# Altium schematic sheet Channels.SchDoc: А
size 420 x 594 mm; ApprovedBy: Крысин; CheckedBy: Крысин; Author: Борисов; DrawnBy: Хрущева; DocumentNumber: 1; SheetNumber: 1; SheetTotal: 1; Title string 2: Плата; Title string 3: HUB IOLINK Cross; Type: Схема электрическая принципиальная; DecimalNumber: БНРД.xxxxxx.xxxЭ3; MainDevice: БНРД.xxxxxx.xxx
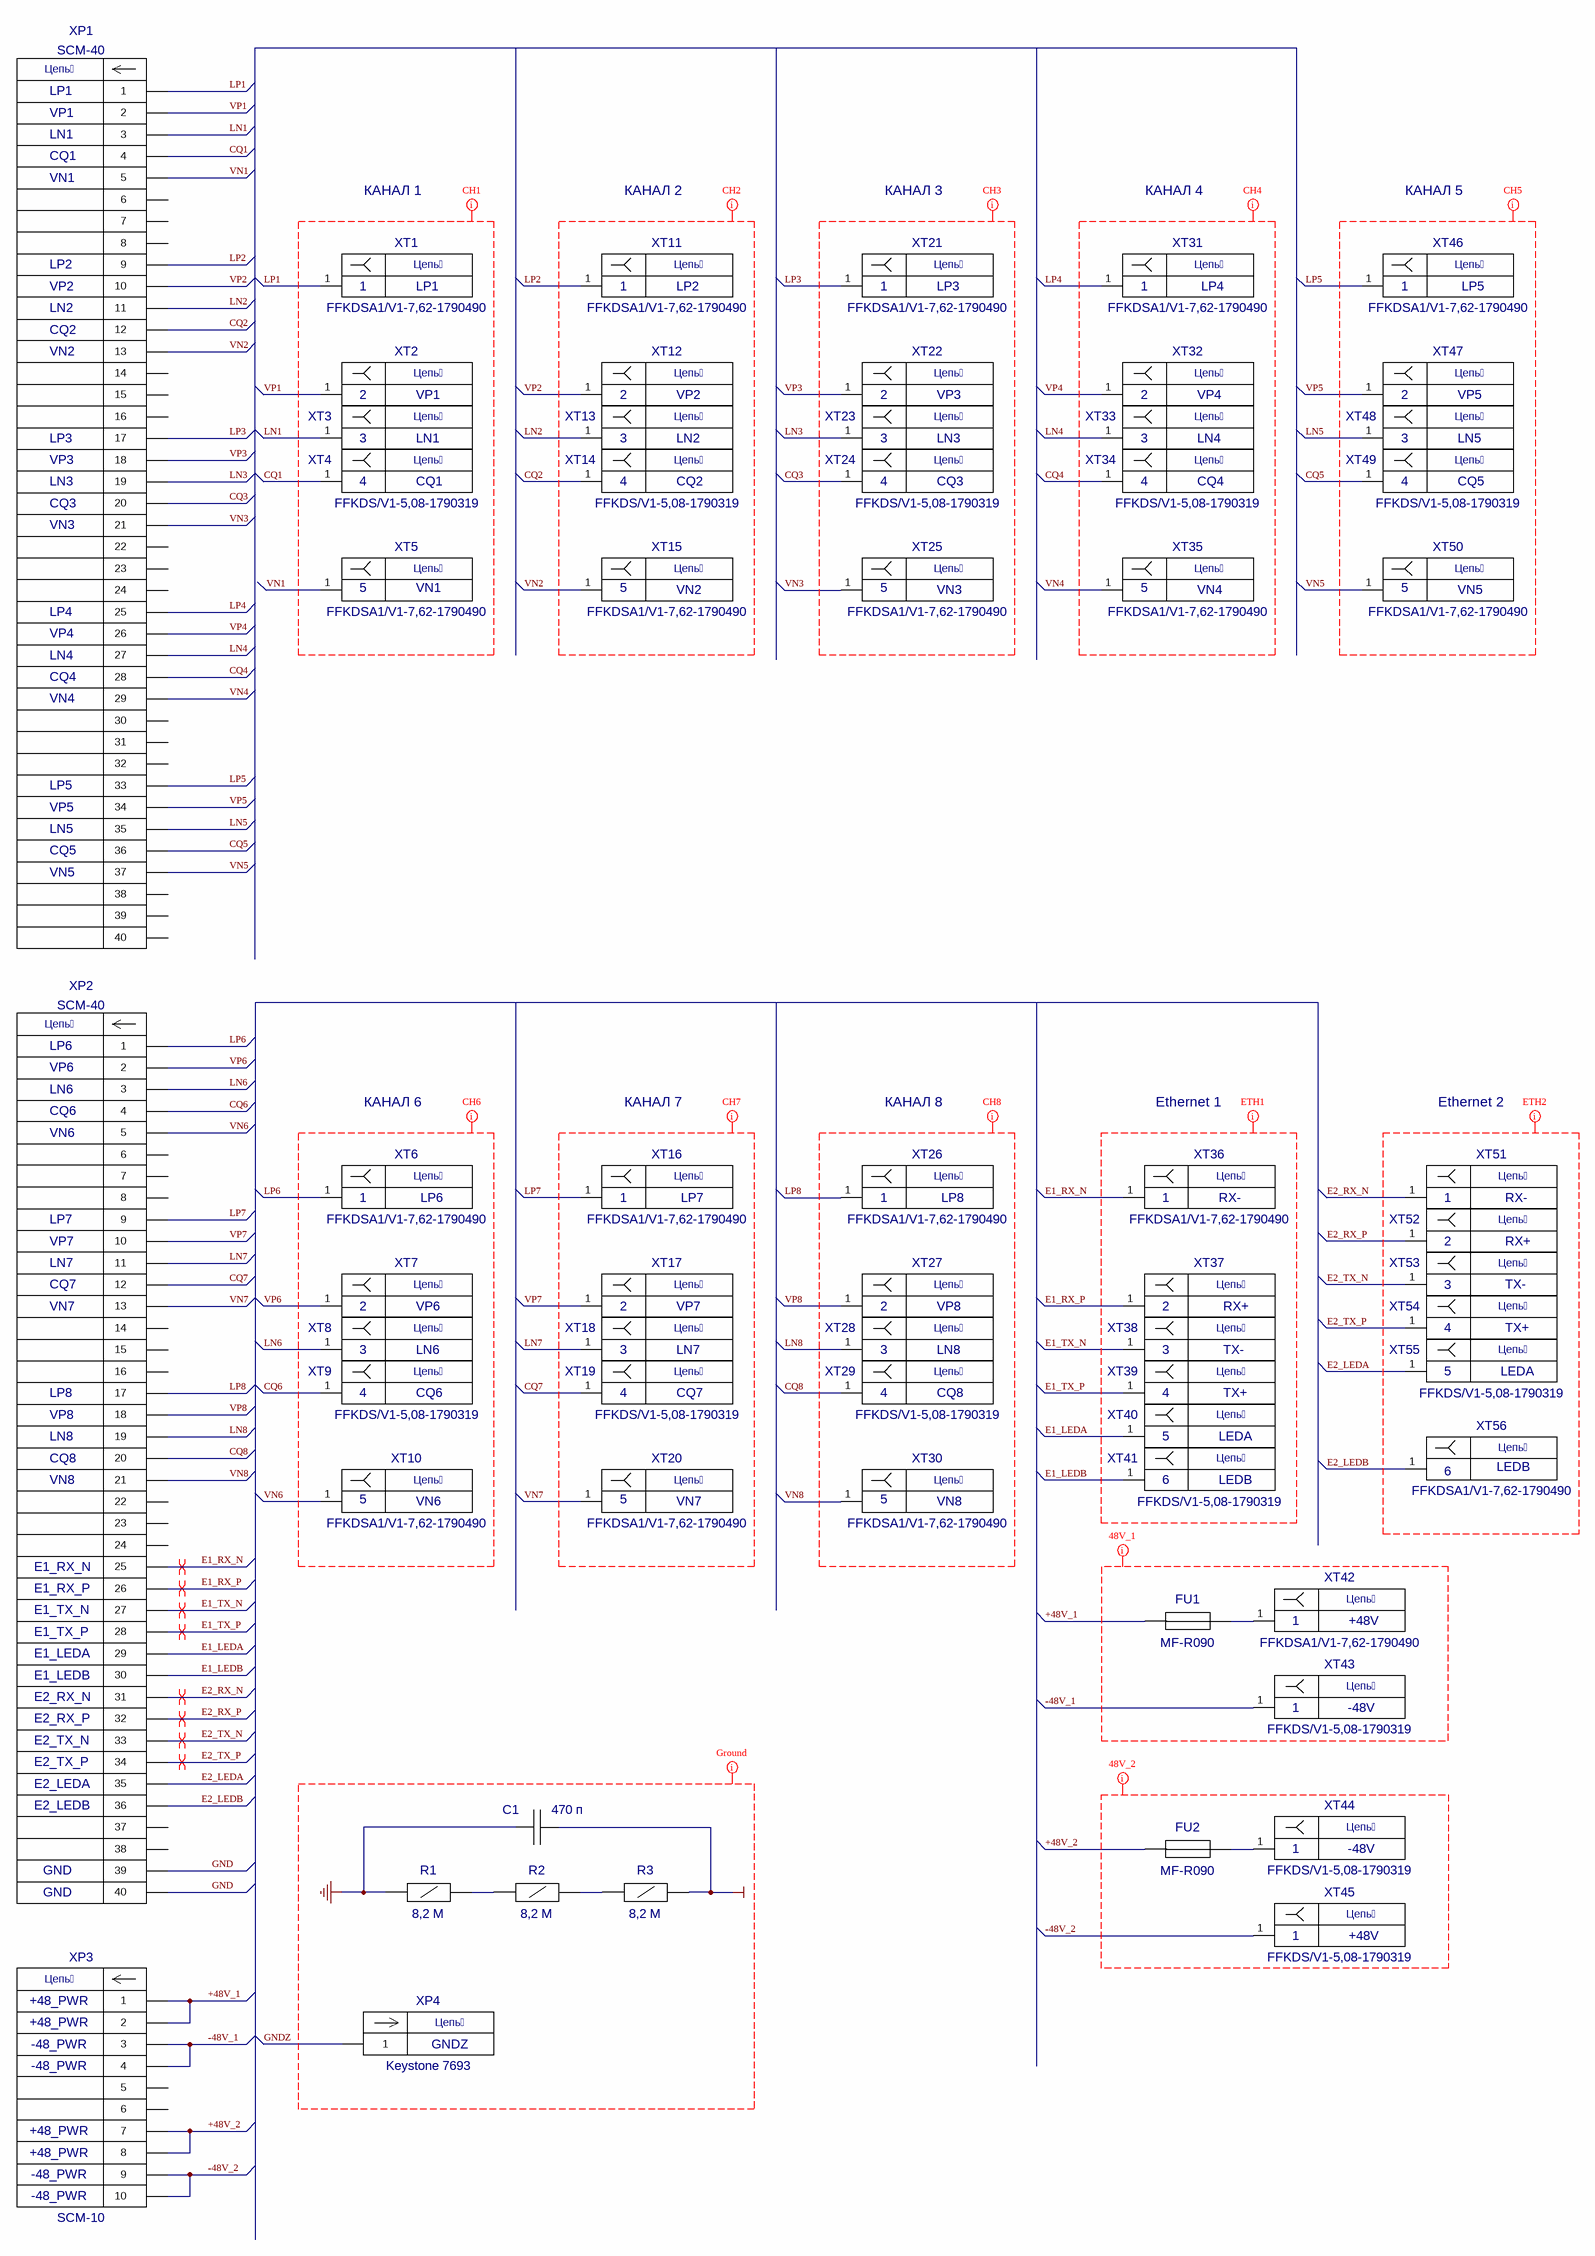
[diagram p0: Channels.SchDoc]

## Parts
C1  value 470 п  [1812]  (hidden comment: C1812)
FU1  MF-R090  [MF-R090]
FU2  MF-R090  [MF-R090]
R1  value 8,2 М  [1206]  (hidden comment: R1206)
R2  value 8,2 М  [1206]  (hidden comment: R1206)
R3  value 8,2 М  [1206]  (hidden comment: R1206)
XP1  SCM-40  [SCM-40]
XP2  SCM-40  [SCM-40]
XP3  SCM-10  [SCM-10]
XP4  Keystone 7693  [KEYSTONE 7693]
XT1  FFKDSA1/V1-7,62-1790490  [FFKDSA1/V1-7,62-1790490]
XT2  FFKDS/V1-5,08-1790319  [FFKDS/V1-5,08-1790319]  (value not drawn)
XT3  FFKDS/V1-5,08-1790319  [FFKDS/V1-5,08-1790319]  (value not drawn)
XT4  FFKDS/V1-5,08-1790319  [FFKDS/V1-5,08-1790319]
XT5  FFKDSA1/V1-7,62-1790490  [FFKDSA1/V1-7,62-1790490]
XT6  FFKDSA1/V1-7,62-1790490  [FFKDSA1/V1-7,62-1790490]
XT7  FFKDS/V1-5,08-1790319  [FFKDS/V1-5,08-1790319]  (value not drawn)
XT8  FFKDS/V1-5,08-1790319  [FFKDS/V1-5,08-1790319]  (value not drawn)
XT9  FFKDS/V1-5,08-1790319  [FFKDS/V1-5,08-1790319]
XT10  FFKDSA1/V1-7,62-1790490  [FFKDSA1/V1-7,62-1790490]
XT11  FFKDSA1/V1-7,62-1790490  [FFKDSA1/V1-7,62-1790490]
XT12  FFKDS/V1-5,08-1790319  [FFKDS/V1-5,08-1790319]  (value not drawn)
XT13  FFKDS/V1-5,08-1790319  [FFKDS/V1-5,08-1790319]  (value not drawn)
XT14  FFKDS/V1-5,08-1790319  [FFKDS/V1-5,08-1790319]
XT15  FFKDSA1/V1-7,62-1790490  [FFKDSA1/V1-7,62-1790490]
XT16  FFKDSA1/V1-7,62-1790490  [FFKDSA1/V1-7,62-1790490]
XT17  FFKDS/V1-5,08-1790319  [FFKDS/V1-5,08-1790319]  (value not drawn)
XT18  FFKDS/V1-5,08-1790319  [FFKDS/V1-5,08-1790319]  (value not drawn)
XT19  FFKDS/V1-5,08-1790319  [FFKDS/V1-5,08-1790319]
XT20  FFKDSA1/V1-7,62-1790490  [FFKDSA1/V1-7,62-1790490]
XT21  FFKDSA1/V1-7,62-1790490  [FFKDSA1/V1-7,62-1790490]
XT22  FFKDS/V1-5,08-1790319  [FFKDS/V1-5,08-1790319]  (value not drawn)
XT23  FFKDS/V1-5,08-1790319  [FFKDS/V1-5,08-1790319]  (value not drawn)
XT24  FFKDS/V1-5,08-1790319  [FFKDS/V1-5,08-1790319]
XT25  FFKDSA1/V1-7,62-1790490  [FFKDSA1/V1-7,62-1790490]
XT26  FFKDSA1/V1-7,62-1790490  [FFKDSA1/V1-7,62-1790490]
XT27  FFKDS/V1-5,08-1790319  [FFKDS/V1-5,08-1790319]  (value not drawn)
XT28  FFKDS/V1-5,08-1790319  [FFKDS/V1-5,08-1790319]  (value not drawn)
XT29  FFKDS/V1-5,08-1790319  [FFKDS/V1-5,08-1790319]
XT30  FFKDSA1/V1-7,62-1790490  [FFKDSA1/V1-7,62-1790490]
XT31  FFKDSA1/V1-7,62-1790490  [FFKDSA1/V1-7,62-1790490]
XT32  FFKDS/V1-5,08-1790319  [FFKDS/V1-5,08-1790319]  (value not drawn)
XT33  FFKDS/V1-5,08-1790319  [FFKDS/V1-5,08-1790319]  (value not drawn)
XT34  FFKDS/V1-5,08-1790319  [FFKDS/V1-5,08-1790319]
XT35  FFKDSA1/V1-7,62-1790490  [FFKDSA1/V1-7,62-1790490]
XT36  FFKDSA1/V1-7,62-1790490  [FFKDSA1/V1-7,62-1790490]
XT37  FFKDS/V1-5,08-1790319  [FFKDS/V1-5,08-1790319]  (value not drawn)
XT38  FFKDS/V1-5,08-1790319  [FFKDS/V1-5,08-1790319]  (value not drawn)
XT39  FFKDS/V1-5,08-1790319  [FFKDS/V1-5,08-1790319]  (value not drawn)
XT40  FFKDS/V1-5,08-1790319  [FFKDS/V1-5,08-1790319]  (value not drawn)
XT41  FFKDS/V1-5,08-1790319  [FFKDS/V1-5,08-1790319]
XT42  FFKDSA1/V1-7,62-1790490  [FFKDSA1/V1-7,62-1790490]
XT43  FFKDS/V1-5,08-1790319  [FFKDS/V1-5,08-1790319]
XT44  FFKDS/V1-5,08-1790319  [FFKDS/V1-5,08-1790319]
XT45  FFKDS/V1-5,08-1790319  [FFKDS/V1-5,08-1790319]
XT46  FFKDSA1/V1-7,62-1790490  [FFKDSA1/V1-7,62-1790490]
XT47  FFKDS/V1-5,08-1790319  [FFKDS/V1-5,08-1790319]  (value not drawn)
XT48  FFKDS/V1-5,08-1790319  [FFKDS/V1-5,08-1790319]  (value not drawn)
XT49  FFKDS/V1-5,08-1790319  [FFKDS/V1-5,08-1790319]
XT50  FFKDSA1/V1-7,62-1790490  [FFKDSA1/V1-7,62-1790490]
XT51  FFKDS/V1-5,08-1790319  [FFKDS/V1-5,08-1790319]  (value not drawn)
XT52  FFKDS/V1-5,08-1790319  [FFKDS/V1-5,08-1790319]  (value not drawn)
XT53  FFKDS/V1-5,08-1790319  [FFKDS/V1-5,08-1790319]  (value not drawn)
XT54  FFKDS/V1-5,08-1790319  [FFKDS/V1-5,08-1790319]  (value not drawn)
XT55  FFKDS/V1-5,08-1790319  [FFKDS/V1-5,08-1790319]
XT56  FFKDSA1/V1-7,62-1790490  [FFKDSA1/V1-7,62-1790490]

## Nets
GND: C1.2 R3.2 XP2.39 XP2.40
GNDZ: C1.1 R1.1 XP4.1
+48V_1: FU1.1(A) XP3.1 XP3.2
+48V_2: FU2.1(A) XP3.7 XP3.8
-48V_1: XP3.3 XP3.4 XT43.1
-48V_2: XP3.9 XP3.10 XT45.1
CQ1: XP1.4 XT4.1
CQ2: XP1.12 XT14.1
CQ3: XP1.20 XT24.1
CQ4: XP1.28 XT34.1
CQ5: XP1.36 XT49.1
CQ6: XP2.4 XT9.1
CQ7: XP2.12 XT19.1
CQ8: XP2.20 XT29.1
E1_LEDA: XP2.29 XT40.1
E1_LEDB: XP2.30 XT41.1
E1_RX_N: XP2.25 XT36.1
E1_RX_P: XP2.26 XT37.1
E1_TX_N: XP2.27 XT38.1
E1_TX_P: XP2.28 XT39.1
E2_LEDA: XP2.35 XT55.1
E2_LEDB: XP2.36 XT56.1
E2_RX_N: XP2.31 XT51.1
E2_RX_P: XP2.32 XT52.1
E2_TX_N: XP2.33 XT53.1
E2_TX_P: XP2.34 XT54.1
LN1: XP1.3 XT3.1
LN2: XP1.11 XT13.1
LN3: XP1.19 XT23.1
LN4: XP1.27 XT33.1
LN5: XP1.35 XT48.1
LN6: XP2.3 XT8.1
LN7: XP2.11 XT18.1
LN8: XP2.19 XT28.1
LP1: XP1.1 XT1.1
LP2: XP1.9 XT11.1
LP3: XP1.17 XT21.1
LP4: XP1.25 XT31.1
LP5: XP1.33 XT46.1
LP6: XP2.1 XT6.1
LP7: XP2.9 XT16.1
LP8: XP2.17 XT26.1
VN1: XP1.5 XT5.1
VN2: XP1.13 XT15.1
VN3: XP1.21 XT25.1
VN4: XP1.29 XT35.1
VN5: XP1.37 XT50.1
VN6: XP2.5 XT10.1
VN7: XP2.13 XT20.1
VN8: XP2.21 XT30.1
VP1: XP1.2 XT2.1
VP2: XP1.10 XT12.1
VP3: XP1.18 XT22.1
VP4: XP1.26 XT32.1
VP5: XP1.34 XT47.1
VP6: XP2.2 XT7.1
VP7: XP2.10 XT17.1
VP8: XP2.18 XT27.1
NetFU1_2: FU1.2(B) XT42.1
NetFU2_2: FU2.2(B) XT44.1
NetR1_2: R1.2 R2.1
NetR2_2: R2.2 R3.1

Not connected (* = marked no-connect by the designer): XP1 6 7 8 14 15 16 22 23 24 30 31 32 38 39 40; XP2 6 7 8 14 15 16 22 23 24 37 38; XP3 5 6; XP4 2 3 4; XT1 2; XT2 2; XT3 2; XT4 2; XT5 2; XT6 2; XT7 2; XT8 2; XT9 2; XT10 2; XT11 2; XT12 2; XT13 2; XT14 2; XT15 2; XT16 2; XT17 2; XT18 2; XT19 2; XT20 2; XT21 2; XT22 2; XT23 2; XT24 2; XT25 2; XT26 2; XT27 2; XT28 2; XT29 2; XT30 2; XT31 2; XT32 2; XT33 2; XT34 2; XT35 2; XT36 2; XT37 2; XT38 2; XT39 2; XT40 2; XT41 2; XT42 2; XT43 2; XT44 2; XT45 2; XT46 2; XT47 2; XT48 2; XT49 2; XT50 2; XT51 2; XT52 2; XT53 2; XT54 2; XT55 2; XT56 2

## Layout directives
net class CH1: (no net found under the mark)
net class CH2: (no net found under the mark)
net class CH3: (no net found under the mark)
net class CH4: (no net found under the mark)
net class CH5: (no net found under the mark)
net class CH6: (no net found under the mark)
net class CH7: (no net found under the mark)
net class CH8: (no net found under the mark)
net class ETH1: (no net found under the mark)
net class ETH2: (no net found under the mark)
differential pair: E1_RX_N, E1_RX_P, E1_TX_N, E1_TX_P, E2_RX_N, E2_RX_P, E2_TX_N, E2_TX_P
net class Ground: GND, GNDZ
net class 48V_1: (no net found under the mark)
net class 48V_2: (no net found under the mark)

## Notes on the sheet
- LP1
- VP1
- LN1
- CQ1
- VN1
- КАНАЛ 1
- КАНАЛ 2
- КАНАЛ 3
- КАНАЛ 4
- КАНАЛ 5
- LP2
- VP2
- LN2
- (near XT1) 1
- (near XT11) 1
- (near XT21) 1
- LP3
- (near XT31) 1
- LP4
- (near XT46) 1
- LP5
- CQ2
- VN2
- (near XT2) 2
- (near XT12) 2
- (near XT22) 2
- VP3
- (near XT32) 2
- VP4
- (near XT47) 2
- VP5
- LN3
- (near XT3) 3
- (near XT4) 4
- (near XT13) 3
- (near XT14) 4
- (near XT23) 3
- (near XT24) 4
- CQ3
- (near XT33) 3
- (near XT34) 4
- LN4
- CQ4
- (near XT48) 3
- (near XT49) 4
- LN5
- CQ5
- VN3
- (near XT5) 5
- (near XT15) 5
- (near XT25) 5
- (near XT35) 5
- VN4
- (near XT50) 5
- VN5
- LP6
- VP6
- LN6
- CQ6
- VN6
- КАНАЛ 6
- КАНАЛ 7
- КАНАЛ 8
- Ethernet 1
- Ethernet 2
- (near XT6) 1
- (near XT16) 1
- LP7
- (near XT26) 1
- LP8
- (near XT36) 1
- RX-
- (near XT51) 1
- VP7
- (near XT52) 2
- RX+
- LN7
- CQ7
- VN7
- (near XT7) 2
- (near XT17) 2
- (near XT27) 2
- VP8
- (near XT37) 2
- (near XT53) 3
- TX-
- (near XT8) 3
- (near XT18) 3
- (near XT28) 3
- LN8
- (near XT38) 3
- (near XT54) 4
- (near XT55) 5
- LEDA
- TX+
- (near XT9) 4
- (near XT19) 4
- (near XT29) 4
- CQ8
- (near XT39) 4
- VN8
- (near XT40) 5
- (near XT41) 6
- LEDB
- (near XT56) 6
- (near XT10) 5
- (near XT20) 5
- (near XT30) 5
- E1_RX_N
- E1_RX_P
- E1_TX_N
- E1_TX_P
- (near XT42) 1
- +48V
- E1_LEDA
- E1_LEDB
- E2_RX_N
- (near XT43) 1
- -48V
- E2_RX_P
- E2_TX_N
- E2_TX_P
- E2_LEDA
- E2_LEDB
- (near XT44) 1
- GND
- (near XT45) 1
- +48_PWR
- -48_PWR
- GNDZ
- Перв.примен.
- Справ.№
- Подп. и дата
- Инв.№ дубл.
- Взам.инв.№
- Подп.и дата
- Разраб.
- Изм
- Лист
- № докум.
- Подп.
- Дата
- Лит.
- Масштаб
- Масса
- Т.контр.
- Пров.
- Листов
- Инв.№ подл.
- Утв.
- Н.контр.
- Согл.
- Распечатано на A3
- Формат:A2
- (in symbol FFKDS/V1-5,08-1790319) Цепь
- (in symbol FFKDSA1/V1-7,62-1790490) Цепь
- (in symbol KEYSTONE 7693) Цепь
- (in symbol SCM-10) Цепь
- (in symbol SCM-40) Цепь

## Library data of the parts
C1 = C1812: DesCommon: 470 пФ ± 10 % - 3 кВ - X7R - 1812; TechSpec: X7R; Tolerance: ± 10 %; Units: Ф; Voltage: 3 кВ; Package: 1812
FU1 FU2 = MF-R090: DesCommon: Предохранитель  MF-R090 Bourns
R1-R3 = R1206: DesCommon: 8,2 МОм ± 5 % - 0,25 Вт - 1206; Power: 0,25 Вт; Tolerance: ± 5 %; Units: Ом; Package: 1206
XP1 XP2 = SCM-40: DesCommon: Вилка SCM-40 «Бурый медведь»
XP3 = SCM-10: DesCommon: Вилка SCM-10 «Бурый медведь»
XP4 = KEYSTONE 7693: DesCommon: Контакт заземления  Keystone 7693
XT1 XT5 XT6 XT10 XT11 XT15 XT16 XT20 XT21 XT25 XT26 XT30 XT31 XT35 XT36 XT42 XT46 XT50 XT56 = FFKDSA1/V1-7,62-1790490: DesCommon: Клемма FFKDSA1/V1-7,62-1790490 Phoenix Contact
XT2-XT4 XT7-XT9 XT12-XT14 XT17-XT19 XT22-XT24 XT27-XT29 XT32-XT34 XT37-XT41 XT43-XT45 XT47-XT49 XT51-XT55 = FFKDS/V1-5,08-1790319: DesCommon: Клемма FFKDS/V1-5,08-1790319 Phoenix Contact